# EAGLE design colpitts (EAGLE 7.2.0)
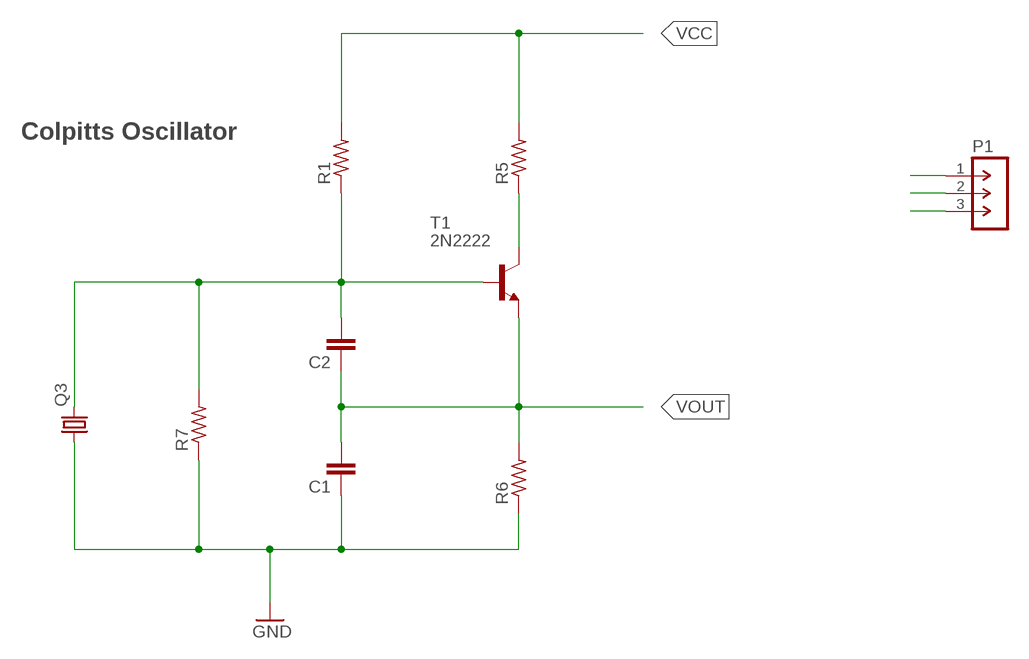
[diagram p0: schematic, sheet 1]

## Parts
C1  C2,5-3  [C2.5-3]
C2  C2,5-3  [C2.5-3]
P1  M-1X03-SIP-100-40  [SIP-100-03-40]
Q3  CRYSTALTC26V  [TC26V]
R1  R-US_0204/5  [0204/5]
R5  R-US_0204/5  [0204/5]
R6  R-US_0204/5  [0204/5]
R7  R-US_0204/5  [0204/5]
T1  2N2222  [TO92-EBC-OVAL]

## Nets
GND: C1.1 P1.3 Q3.1 R6.1 R7.1
N$4: R5.1 T1.C
N$5: C2.2 Q3.2 R1.1 R7.2 T1.B
VCC: P1.1 R1.2 R5.2
VOUT: C1.2 C2.1 P1.2 R6.2 T1.E

## Notes on the sheet
- Colpitts Oscillator

## Library data of the parts
C1 C2 = capacitor-wima:C: CAPACITOR naming: grid - package width
P1 = con-headers-jp:M-1X03-: MALE HEADER
Q3 = crystal:CRYSTAL: CRYSTAL; OC_FARNELL: unknown; OC_NEWARK: unknown
R1 R5-R7 = adafruit:R-US_: RESISTOR, American symbol
T1 = adafruit:2N2222: NPN TRANSISTOR Big oval pads

## Board
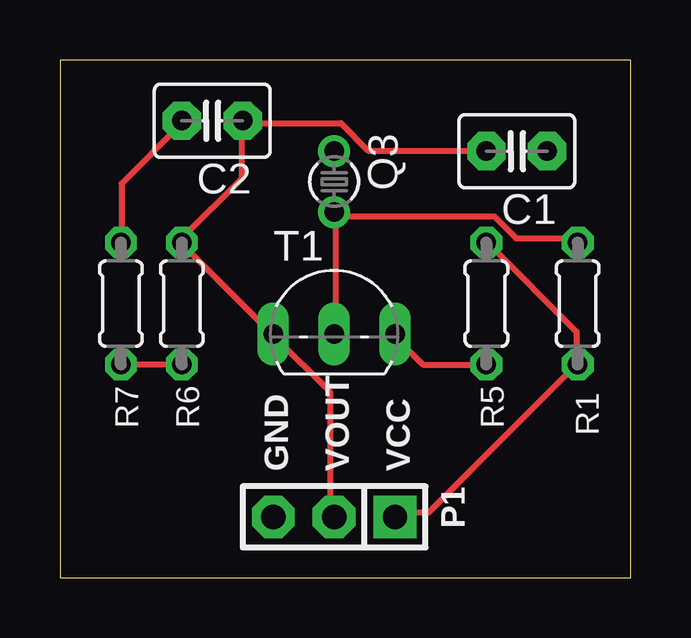
[diagram p1: board, top side]
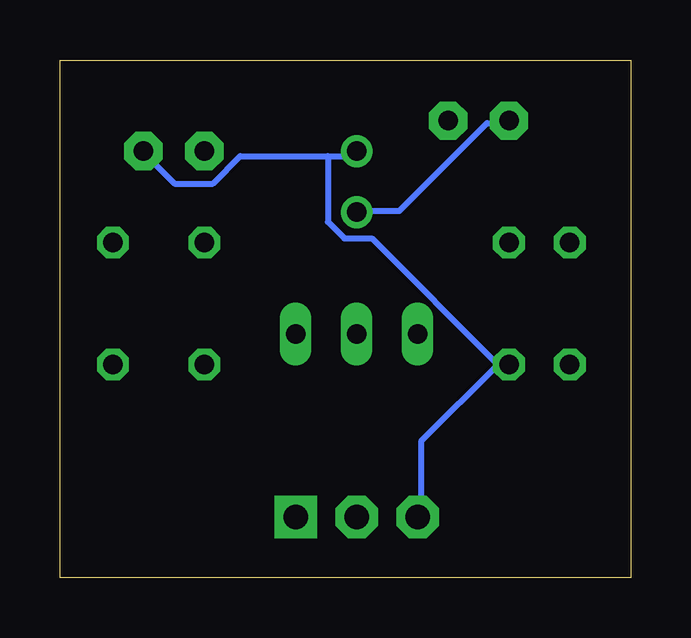
[diagram p2: board, bottom side, seen from below]

Size 23.8 x 21.58 mm. Coordinates in mm from the lower left corner, seen from the top.
Outline: 0,0 23.8,0 23.8,21.58 0,21.58 0,0
Copper layers (1*16): Top 0.035mm / dielectric 1.5mm / Bottom 0.035mm
Design rules "SeeedStudio_2layer_DRU_no_angle_20140221": minimum track width 6mil, minimum drill 12mil, track to track 6mil, track to pad 6mil, pad to pad 6mil, via to via 6mil, smd to smd 0mil, copper to edge 10mil, drill to drill 10mil, minimum pad ring 10mil, minimum via ring 6mil, stop-mask expansion 2mil, vias tented up to drill 100mil, thermal gap 10mil

### Footprints (pad centres in the part's own frame; a part is rotated, then mirrored left to right if it is on the bottom)
C2.5-3 = drill 0.813 pad 1.6 octagon: 1 -1.27,0; 2 1.27,0
SIP-100-03-40 = drill 1.016 pad 1.778 square: 1 -2.54,0 | drill 1.016 pad 1.778 octagon: 2 0,0; 3 2.54,0
TC26V = drill 0.813: 1 -1.27,0; 2 1.27,0
0204/5 = drill 0.813 octagon: 1 -2.54,0; 2 2.54,0
TO92-EBC-OVAL = drill 0.813 long: B 0,-1.27; C 2.54,-1.27; E -2.54,-1.27

### Placement (x,y rotation side)
C1  19.05,17.78 180 top
C2  6.35,19.05 180 top
P1  11.43,2.54 180 top
Q3  11.43,16.51 270 top
R1  21.59,11.43 270 top
R5  17.78,11.43 90 top
R6  5.08,11.43 90 top
R7  2.54,11.43 90 top
T1  11.43,11.43 0 top

### Tracks (layer width: path | path; a pad name or v marks a point on that pad's centre or on a via)
GND
  Top 0.254: R6.1 R7.1
  Bottom 0.254: 12.62,17.58 16.28,17.58 17.42,16.43 19.02,16.43 20.17,17.58 C1.1 | 12.62,17.58 11.48,17.58 Q3.1 | 5.54,8.89 10.79,14.15 11.94,14.15 12.62,14.83 12.62,17.58 | 5.54,8.89 8.74,5.69 8.74,2.72 P1.3 | 5.54,8.89 R6.1
N$4
  Top 0.254: R5.1 15.14,8.89 13.99,10.03 T1.C
N$5
  Top 0.254: R7.2 2.56,14.15 2.56,16.43 5.08,18.95 C2.2 | 11.48,15.06 11.48,10.26 T1.B | 11.48,15.06 18.11,15.06 19.02,14.15 21.54,14.15 R1.1 | 11.48,15.06 Q3.2
  Bottom 0.254: C2.2 5.08,18.95 5.99,18.95 9.65,15.29 11.25,15.29 Q3.2
VCC
  Top 0.254: 21.54,8.89 21.54,10.26 17.88,13.92 R5.2 | 21.54,8.89 15.37,2.72 13.99,2.72 P1.1 | 21.54,8.89 R1.2
VOUT
  Top 0.254: C1.2 17.65,17.8 12.85,17.8 11.71,18.95 7.82,18.95 C2.1 7.59,18.95 7.59,16.66 5.08,14.15 R6.2 5.08,13.92 8.74,10.26 T1.E 8.97,10.03 11.25,7.75 11.25,2.72 P1.2

### Text on the board
tNames: GND | VOUT | VCC